# EAGLE design 3.5mm_RCA_breakout (EAGLE 7.3.0)
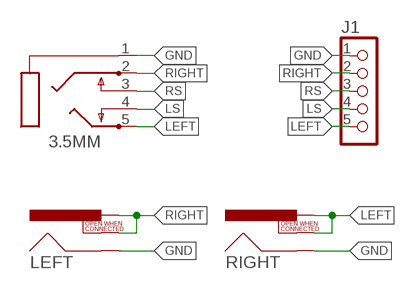
[diagram p0: schematic, sheet 1]

## Parts
3.5MM  STEREOJACK  [STX3100]
J1  CON_HEADER_1X05-PTH  [M1X5]
LEFT  RCA  [RCA]
RIGHT  RCA  [RCA]

## Nets
GND: 3.5MM.1 J1.1 LEFT.SHELL RIGHT.SHELL
LEFT: 3.5MM.5 J1.5 RIGHT.PIN RIGHT.SWITCH
LS: 3.5MM.4 J1.4
RIGHT: 3.5MM.2 J1.2 LEFT.PIN LEFT.SWITCH
RS: 3.5MM.3 J1.3

## Library data of the parts
3.5MM = adafruit:STEREOJACK: MIC/HEADPHONE JACK Stereo jack with two switches. Kycon STX3100, CUI SJ1-3555NG and/or 4UCon 05544
J1 = dp_devices:CON_HEADER_1X05
LEFT RIGHT = SparkFun-Connectors:RCA

## Board
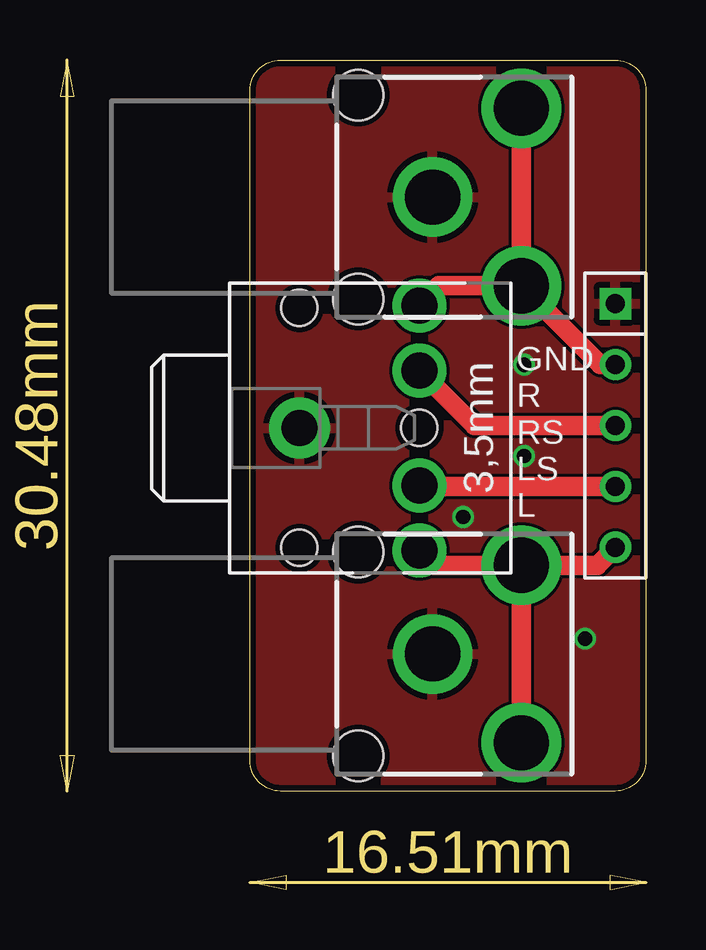
[diagram p1: board, top side]
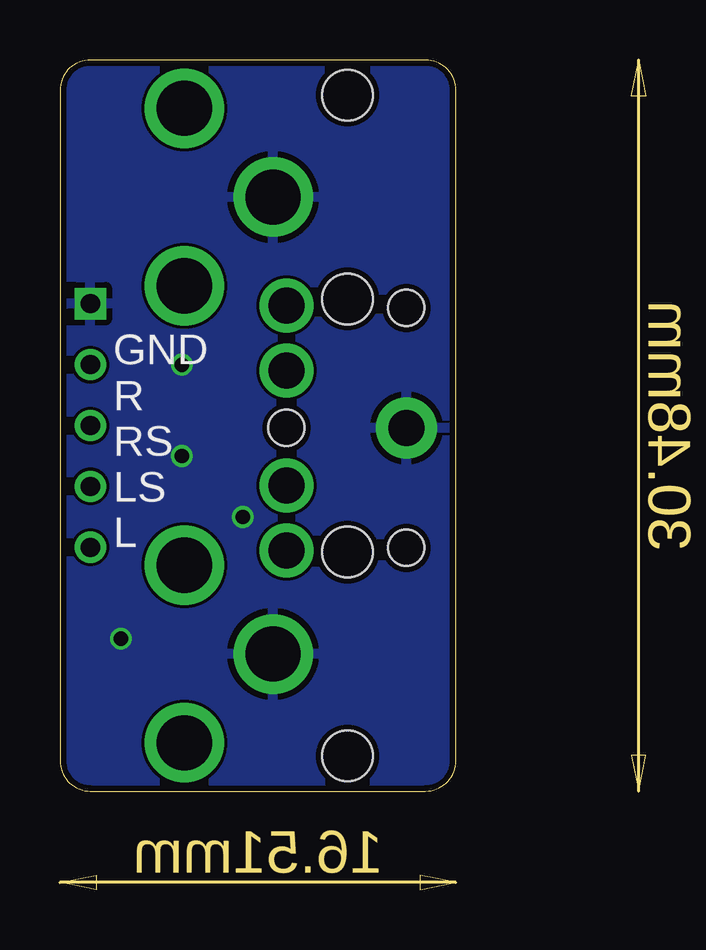
[diagram p2: board, bottom side, seen from below]

Size 16.51 x 30.48 mm. Coordinates in mm from the lower left corner, seen from the top.
Outline: 16.51,29.21 16.51,1.27 arc-90 15.24,0 1.27,0 arc-90 0,1.27 0,29.21 arc-90 1.27,30.48 15.24,30.48 arc-90 16.51,29.21
Copper layers (1*16): Top 0.035mm / dielectric 1.5mm / Bottom 0.035mm
Design rules "dirt_cheap_dirty_boards.v1": minimum track width 5mil, minimum drill 12mil, track to track 5mil, track to pad 5mil, pad to pad 5mil, via to via 5mil, smd to smd 0mil, copper to edge 10mil, drill to drill 10mil, minimum pad ring 10mil, minimum via ring 6mil, stop-mask expansion 2mil, vias tented up to drill 25mil, thermal gap 10mil

### Footprints (pad centres in the part's own frame; a part is rotated, then mirrored left to right if it is on the bottom)
STX3100 = drill 1.5 pad 2.54: 1 2.7,-0.1 | drill 1.5: 2 7.7,5; 3 7.7,2.3; 4 7.7,-2.5; 5 7.7,-5.2 | hole 1.5: 2.7,4.9; 2.7,-5.1; 7.7,-0.1
M1X5 = drill 0.8 square: 1 -5.08,0 | drill 0.8: 2 -2.54,0; 3 0,0; 4 2.54,0; 5 5.08,0
RCA = drill 2.3: PIN 3.7,3.7; SHELL 0,0; SWITCH 3.7,-3.7 | hole 2.1: -3.1,4.25; -3.1,-4.25

### Placement (x,y rotation side)
3.5MM  -0.64,15.24 0 top
J1  15.24,15.24 270 top
LEFT  7.62,24.77 0 top
RIGHT  7.62,5.71 0 top

### Tracks (layer width: path | path; a pad name or v marks a point on that pad's centre or on a via)
GND  (via drill 0.6)
  other vias: 11.43,17.78 11.43,13.97 8.89,11.43 13.97,6.35
  pour Top: 0,30.48 16.51,30.48 16.51,0 0,0
  pour Bottom: 16.51,30.48 0,30.48 0,0 16.51,0
LEFT
  Top 0.813: J1.5 14.49,9.41 RIGHT.PIN | RIGHT.PIN RIGHT.SWITCH | RIGHT.PIN 7.69,9.41 3.5MM.5
LS
  Top 0.813: J1.4 7.11,12.7 3.5MM.4
RIGHT
  Top 0.813: J1.2 14.61,17.78 LEFT.SWITCH | LEFT.SWITCH 7.89,21.07 3.5MM.2 | LEFT.SWITCH LEFT.PIN
RS
  Top 0.813: J1.3 9.37,15.24 3.5MM.3

### Text on the board
tNames: GND / R / RS / LS / L
bNames: GND / R / RS / LS / L